# Altium project p4_mini_board.PrjPcb
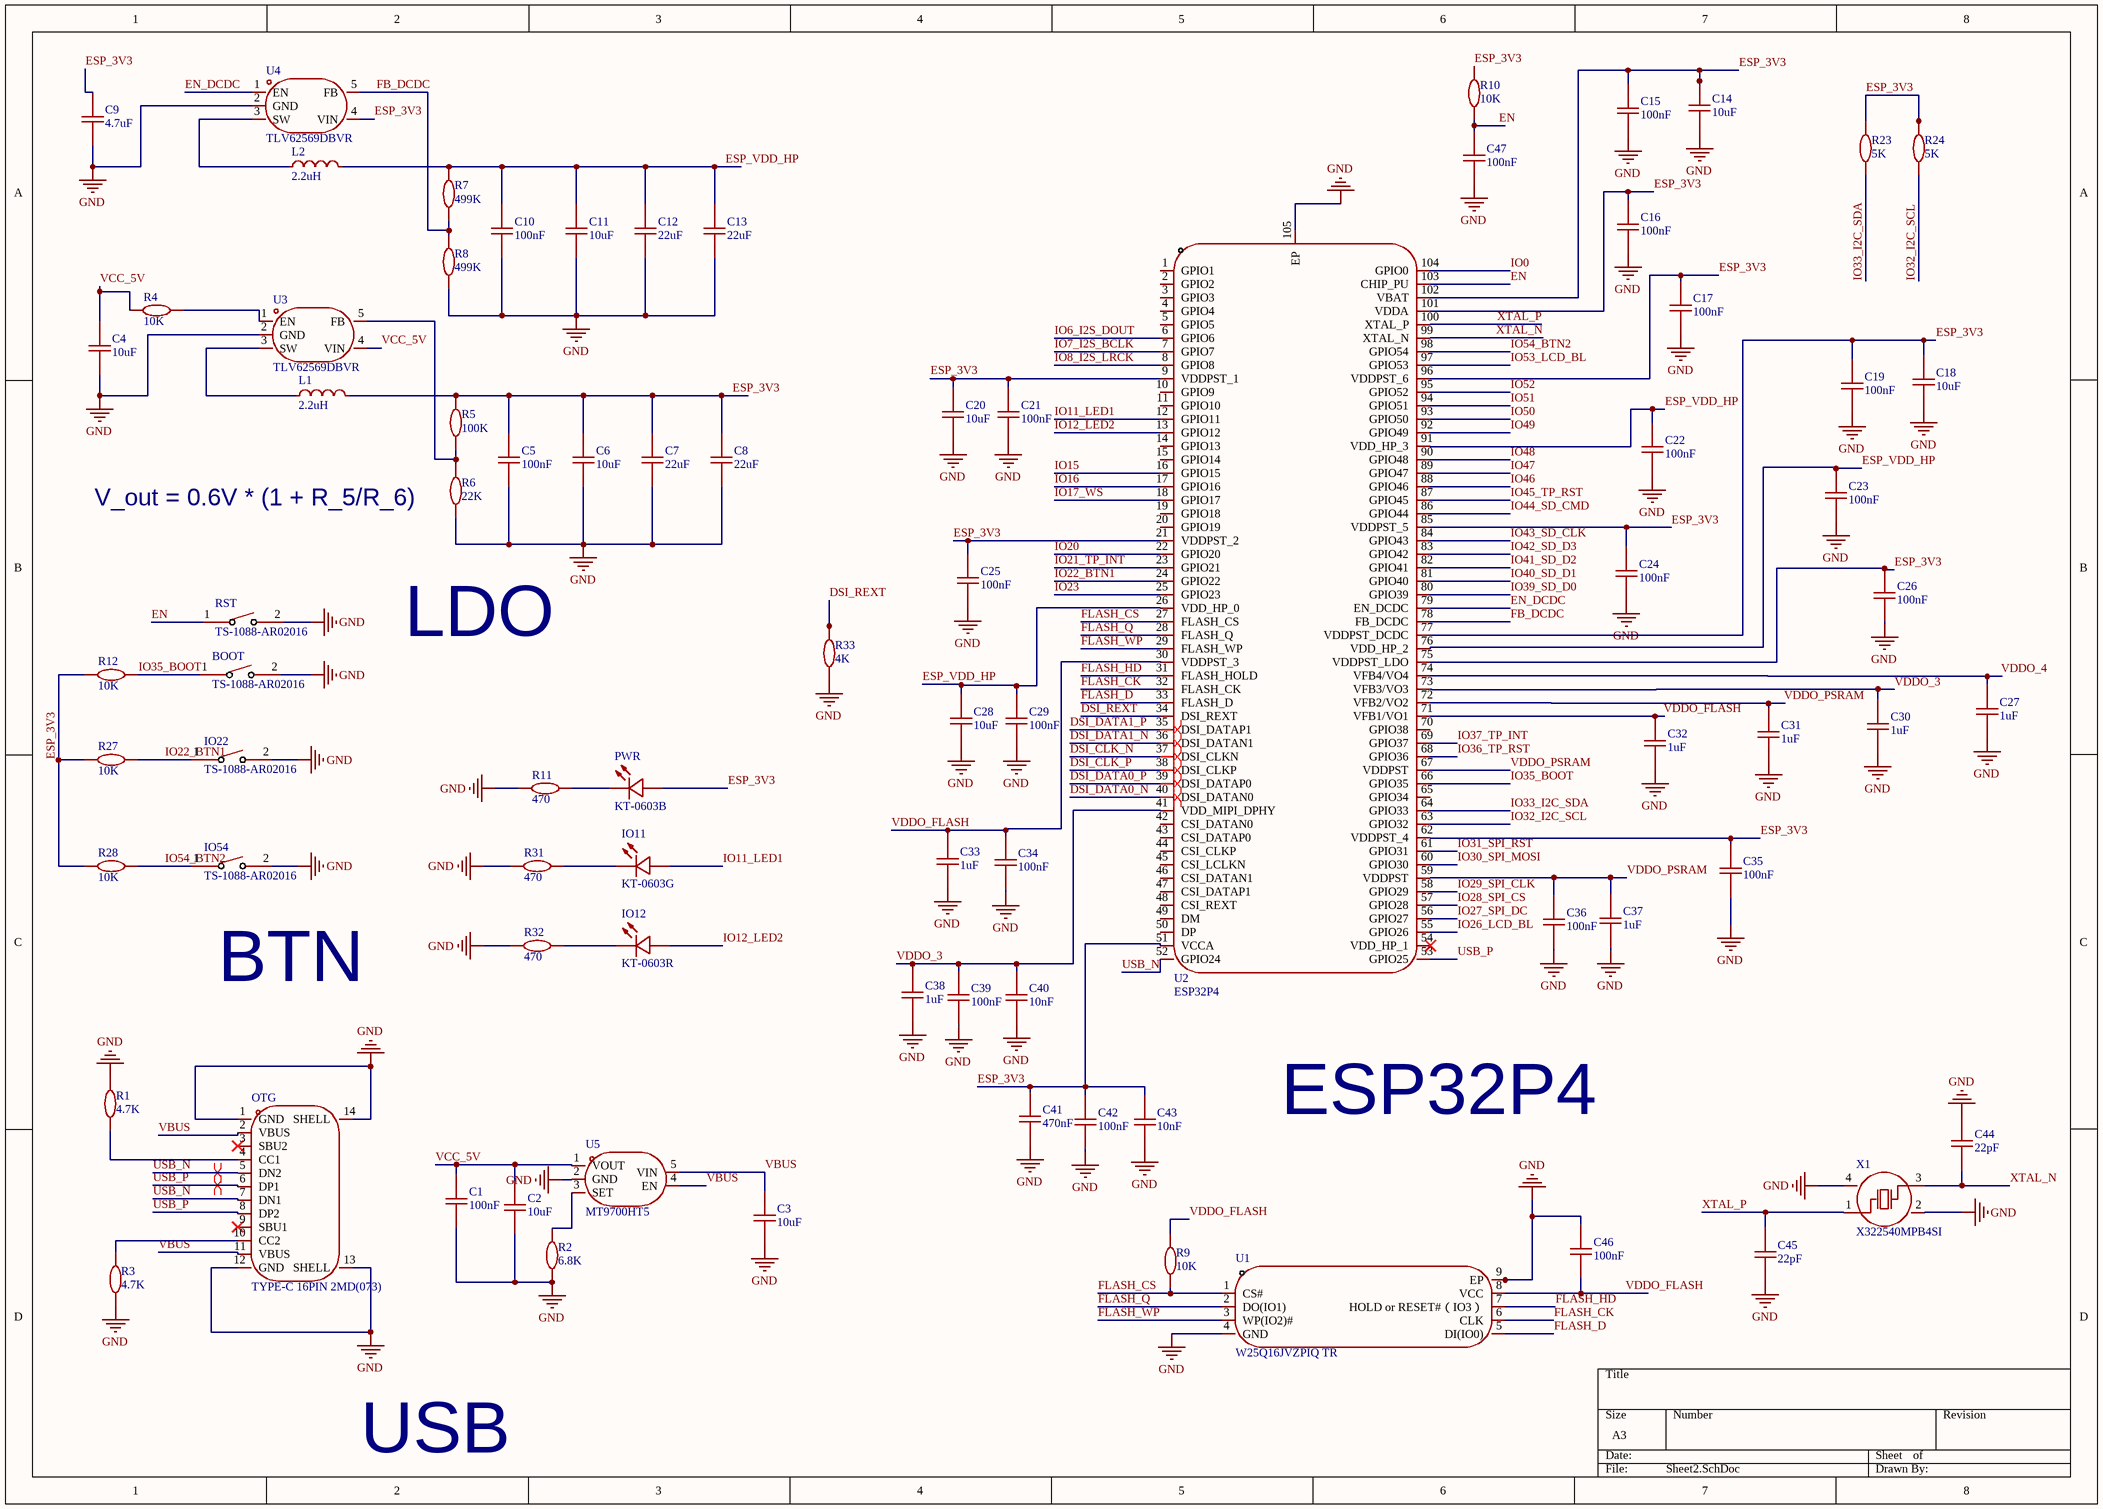
[diagram p0: Sheet2.SchDoc]
2 sheets, 119 parts. Net scope: global (net labels, ports and power ports of the same name join across sheets).
Board file: PCB2.PcbDoc
Sheets:
  Sheet2.SchDoc
  Sheet1.SchDoc

## Sheet Sheet2.SchDoc
size A3; SheetNumber: 1; SheetTotal: 2

### Parts
BOOT  TS-1088-AR02016  [SW-SMD_L3.9-W3.0-P4.45]
C1  100nF  [C0402]
C2  10uF  [C0603]
C3  10uF  [C0603]
C4  10uF  [C0603]
C5  100nF  [C0402]
C6  10uF  [C0603]
C7  22uF  [C0603]
C8  22uF  [C0603]
C9  4.7uF  [C0603]
C10  100nF  [C0402]
C11  10uF  [C0603]
C12  22uF  [C0603]
C13  22uF  [C0603]
C14  10uF  [C0603]
C15  100nF  [C0402]
C16  100nF  [C0402]
C17  100nF  [C0402]
C18  10uF  [C0603]
C19  100nF  [C0402]
C20  10uF  [C0603]
C21  100nF  [C0402]
C22  100nF  [C0402]
C23  100nF  [C0402]
C24  100nF  [C0402]
C25  100nF  [C0402]
C26  100nF  [C0402]
C27  1uF  [C0402]
C28  10uF  [C0603]
C29  100nF  [C0402]
C30  1uF  [C0402]
C31  1uF  [C0402]
C32  1uF  [C0402]
C33  1uF  [C0402]
C34  100nF  [C0402]
C35  100nF  [C0402]
C36  100nF  [C0402]
C37  1uF  [C0402]
C38  1uF  [C0402]
C39  100nF  [C0402]
C40  10nF  [C0402]
C41  470nF  [C0402]
C42  100nF  [C0402]
C43  10nF  [C0402]
C44  22pF  [C0402]
C45  22pF  [C0402]
C46  100nF  [C0402]
C47  100nF  [C0402]
IO11  KT-0603G  [LED0603-GR]
IO12  KT-0603R  [LED0603-RD]
IO22  TS-1088-AR02016  [SW-SMD_L3.9-W3.0-P4.45]
IO54  TS-1088-AR02016  [SW-SMD_L3.9-W3.0-P4.45]
L1  2.2uH  [L0402-SMD]
L2  2.2uH  [L0402-SMD]
OTG  TYPE-C 16PIN 2MD(073)  [USB-C-SMD_TYPE-C-6PIN-2MD-073]
PWR  KT-0603B  [LED0603-BL]
R1  4.7K  [R0402]
R2  6.8K  [R0402]
R3  4.7K  [R0402]
R4  10K  [R0402]
R5  100K  [R0402]
R6  22K  [R0402]
R7  499K  [R0402]
R8  499K  [R0402]
R9  10K  [R0402]
R10  10K  [R0402]
R11  470  [R0402]
R12  10K  [R0402]
R23  5K  [R0402]
R24  5K  [R0402]
R27  10K  [R0402]
R28  10K  [R0402]
R31  470  [R0402]
R32  470  [R0402]
R33  4K  [R0402]
RST  TS-1088-AR02016  [SW-SMD_L3.9-W3.0-P4.45]
U1  W25Q16JVZPIQ TR  [WSON-8_L6.0-W5.0-P1.27-BL-EP]
U2  ESP32P4  [QFN-104_L10.0-W10.0-P0.35-TL-EP7.5]
U3  TLV62569DBVR  [SOT-23-5_L3.0-W1.7-P0.95-LS2.8-BR]
U4  TLV62569DBVR  [SOT-23-5_L3.0-W1.7-P0.95-LS2.8-BR]
U5  MT9700HT5  [SOT-23-5_L3.0-W1.7-P0.95-LS2.8-BL]
X1  X322540MPB4SI  [OSC-SMD_4P-L3.2-W2.5-BL_SIT8008BI]

### Nets
GND: BOOT.2 C1.1 C2.2 C3.2 C4.2 C5.1 C6.1 C7.1 C8.1 C9.2 C10.1 C11.1 C12.1 C13.1 C14.1 C15.1 C16.1 C17.1 C18.1 C19.1 C20.1 C21.1 C22.1 C23.1 C24.1 C25.1 C26.1 C27.1 C28.1 C29.1 C30.1 C31.1 C32.1 C33.1 C34.1 C35.1 C36.1 C37.1 C38.1 C39.1 C40.1 C41.1 C42.1 C43.1 C44.2 C45.1 C46.2 C47.1 IO22.2 IO54.2 OTG.1(GND) OTG.12(GND) OTG.13(SHELL) OTG.14(SHELL) R1.2 R2.2 R3.1 R6.1 R8.1 R11.2 R31.2 R32.2 R33.2 RST.2 U1.4(GND) U1.9(EP) U2.105(EP) U3.2(GND) U4.2(GND) U5.2(GND) X1.2(GND) X1.4(GND)
DSI_CLK_N: U2.37(DSI_CLKN)
DSI_CLK_P: U2.38(DSI_CLKP)
DSI_DATA0_N: U2.40(DSI_DATAN0)
DSI_DATA0_P: U2.39(DSI_DATAP0)
DSI_DATA1_N: U2.36(DSI_DATAN1)
DSI_DATA1_P: U2.35(DSI_DATAP1)
DSI_REXT: R33.1 U2.34(DSI_REXT)
EN: C47.2 R10.1 RST.1 U2.103(CHIP_PU)
EN_DCDC: U2.79(EN_DCDC) U4.1(EN)
ESP_3V3: C5.2 C6.2 C7.2 C8.2 C9.1 C14.2 C15.2 C16.2 C17.2 C18.2 C19.2 C20.2 C21.2 C24.2 C25.2 C26.2 C35.2 C41.2 C42.2 C43.2 L1.2 PWR.2(A) R5.2 R10.2 R12.2 R23.2 R24.2 R27.2 R28.2 U2.9(VDDPST_1) U2.21(VDDPST_2) U2.51(VCCA) U2.62(VDDPST_4) U2.75(VDDPST_LDO) U2.77(VDDPST_DCDC) U2.85(VDDPST_5) U2.96(VDDPST_6) U2.101(VDDA) U2.102(VBAT) U4.4(VIN)
ESP_VDD_HP: C10.2 C11.2 C12.2 C13.2 C22.2 C23.2 C28.2 C29.2 L2.2 R7.2 U2.26(VDD_HP_0) U2.76(VDD_HP_2) U2.91(VDD_HP_3)
FB_DCDC: R7.1 R8.2 U2.78(FB_DCDC) U4.5(FB)
FLASH_CK: U1.6(CLK) U2.32(FLASH_CK)
FLASH_CS: R9.1 U1.1(CS#) U2.27(FLASH_CS)
FLASH_D: U1.5(DI(IO0)) U2.33(FLASH_D)
FLASH_HD: U1.7(HOLD_or_RESET#（IO3）) U2.31(FLASH_HOLD)
FLASH_Q: U1.2(DO(IO1)) U2.28(FLASH_Q)
FLASH_WP: U1.3(WP(IO2)#) U2.29(FLASH_WP)
IO0: U2.104(GPIO0)
IO6_I2S_DOUT: U2.6(GPIO6)
IO7_I2S_BCLK: U2.7(GPIO7)
IO8_I2S_LRCK: U2.8(GPIO8)
IO11_LED1: IO11.2(A) U2.12(GPIO11)
IO12_LED2: IO12.2(A) U2.13(GPIO12)
IO15: U2.16(GPIO15)
IO16: U2.17(GPIO16)
IO17_WS: U2.18(GPIO17)
IO20: U2.22(GPIO20)
IO21_TP_INT: U2.23(GPIO21)
IO22_BTN1: IO22.1 R27.1 U2.24(GPIO22)
IO23: U2.25(GPIO23)
IO26_LCD_BL: U2.55(GPIO26)
IO27_SPI_DC: U2.56(GPIO27)
IO28_SPI_CS: U2.57(GPIO28)
IO29_SPI_CLK: U2.58(GPIO29)
IO30_SPI_MOSI: U2.60(GPIO30)
IO31_SPI_RST: U2.61(GPIO31)
IO32_I2C_SCL: R24.1 U2.63(GPIO32)
IO33_I2C_SDA: R23.1 U2.64(GPIO33)
IO35_BOOT: BOOT.1 R12.1 U2.66(GPIO35)
IO36_TP_RST: U2.68(GPIO36)
IO37_TP_INT: U2.69(GPIO37)
IO39_SD_D0: U2.80(GPIO39)
IO40_SD_D1: U2.81(GPIO40)
IO41_SD_D2: U2.82(GPIO41)
IO42_SD_D3: U2.83(GPIO42)
IO43_SD_CLK: U2.84(GPIO43)
IO44_SD_CMD: U2.86(GPIO44)
IO45_TP_RST: U2.87(GPIO45)
IO46: U2.88(GPIO46)
IO47: U2.89(GPIO47)
IO48: U2.90(GPIO48)
IO49: U2.92(GPIO49)
IO50: U2.93(GPIO50)
IO51: U2.94(GPIO51)
IO52: U2.95(GPIO52)
IO53_LCD_BL: U2.97(GPIO53)
IO54_BTN2: IO54.1 R28.1 U2.98(GPIO54)
USB_N: OTG.5(DN2) OTG.7(DN1) U2.52(GPIO24)
USB_P: OTG.6(DP1) OTG.8(DP2) U2.53(GPIO25)
VBUS: C3.1 OTG.2(VBUS) OTG.11(VBUS) U5.4(EN) U5.5(VIN)
VCC_5V: C1.2 C2.1 C4.1 R4.2 U3.4(VIN) U5.1(VOUT)
VDDO_3: C30.2 C38.2 C39.2 C40.2 U2.41(VDD_MIPI_DPHY) U2.73(VFB3/VO3)
VDDO_4: C27.2 U2.74(VFB4/VO4)
VDDO_FLASH: C32.2 C33.2 C34.2 C46.1 R9.2 U1.8(VCC) U2.30(VDDPST_3) U2.71(VFB1/VO1)
VDDO_PSRAM: C31.2 C36.2 C37.2 U2.59(VDDPST) U2.67(VDDPST) U2.72(VFB2/VO2)
XTAL_N: C44.1 U2.99(XTAL_N) X1.3(OSC2)
XTAL_P: C45.2 U2.100(XTAL_P) X1.1(OSC1)
NetIO11_1: IO11.1(K) R31.1
NetIO12_1: IO12.1(K) R32.1
NetL1_1: L1.1 U3.3(SW)
NetL2_1: L2.1 U4.3(SW)
NetOTG_4: OTG.4(CC1) R1.1
NetOTG_10: OTG.10(CC2) R3.2
NetPWR_1: PWR.1(K) R11.1
NetR2_1: R2.1 U5.3(SET)
NetR4_1: R4.1 U3.1(EN)
NetR5_1: R5.1 R6.2 U3.5(FB)

Not connected (* = marked no-connect by the designer): OTG 3(SBU2)* 9(SBU1)*; U2 1(GPIO1) 2(GPIO2) 3(GPIO3) 4(GPIO4) 5(GPIO5) 10(GPIO9) 11(GPIO10) 14(GPIO13) 15(GPIO14) 19(GPIO18) 20(GPIO19) 42(CSI_DATAN0) 43(CSI_DATAP0) 44(CSI_CLKP) 45(CSI_LCLKN) 46(CSI_DATAN1) 47(CSI_DATAP1) 48(CSI_REXT) 49(DM) 50(DP) 54(VDD_HP_1)* 65(GPIO34) 70(GPIO38)

### Layout directives
differential pair: DSI_CLK_N, DSI_CLK_P, DSI_DATA0_N, DSI_DATA0_P, DSI_DATA1_N, DSI_DATA1_P, USB_N, USB_P

### Notes on the sheet
- (near R6) V_out = 0.6V * (1 + R_5/R_6)
- LDO
- (near IO54) BTN
- ESP32P4
- USB

### Library data of the parts
C1 C5 C10 C15-C17 C19 C21-C27 C29-C47 = C0402
C2-C4 C6-C9 C11-C14 C18 C20 C28 = C0603
L1 L2 = L0402-SMD
R1-R12 R23 R24 R27 R28 R31-R33 = R0402

## Sheet Sheet1.SchDoc
size A3; SheetNumber: 2; SheetTotal: 2
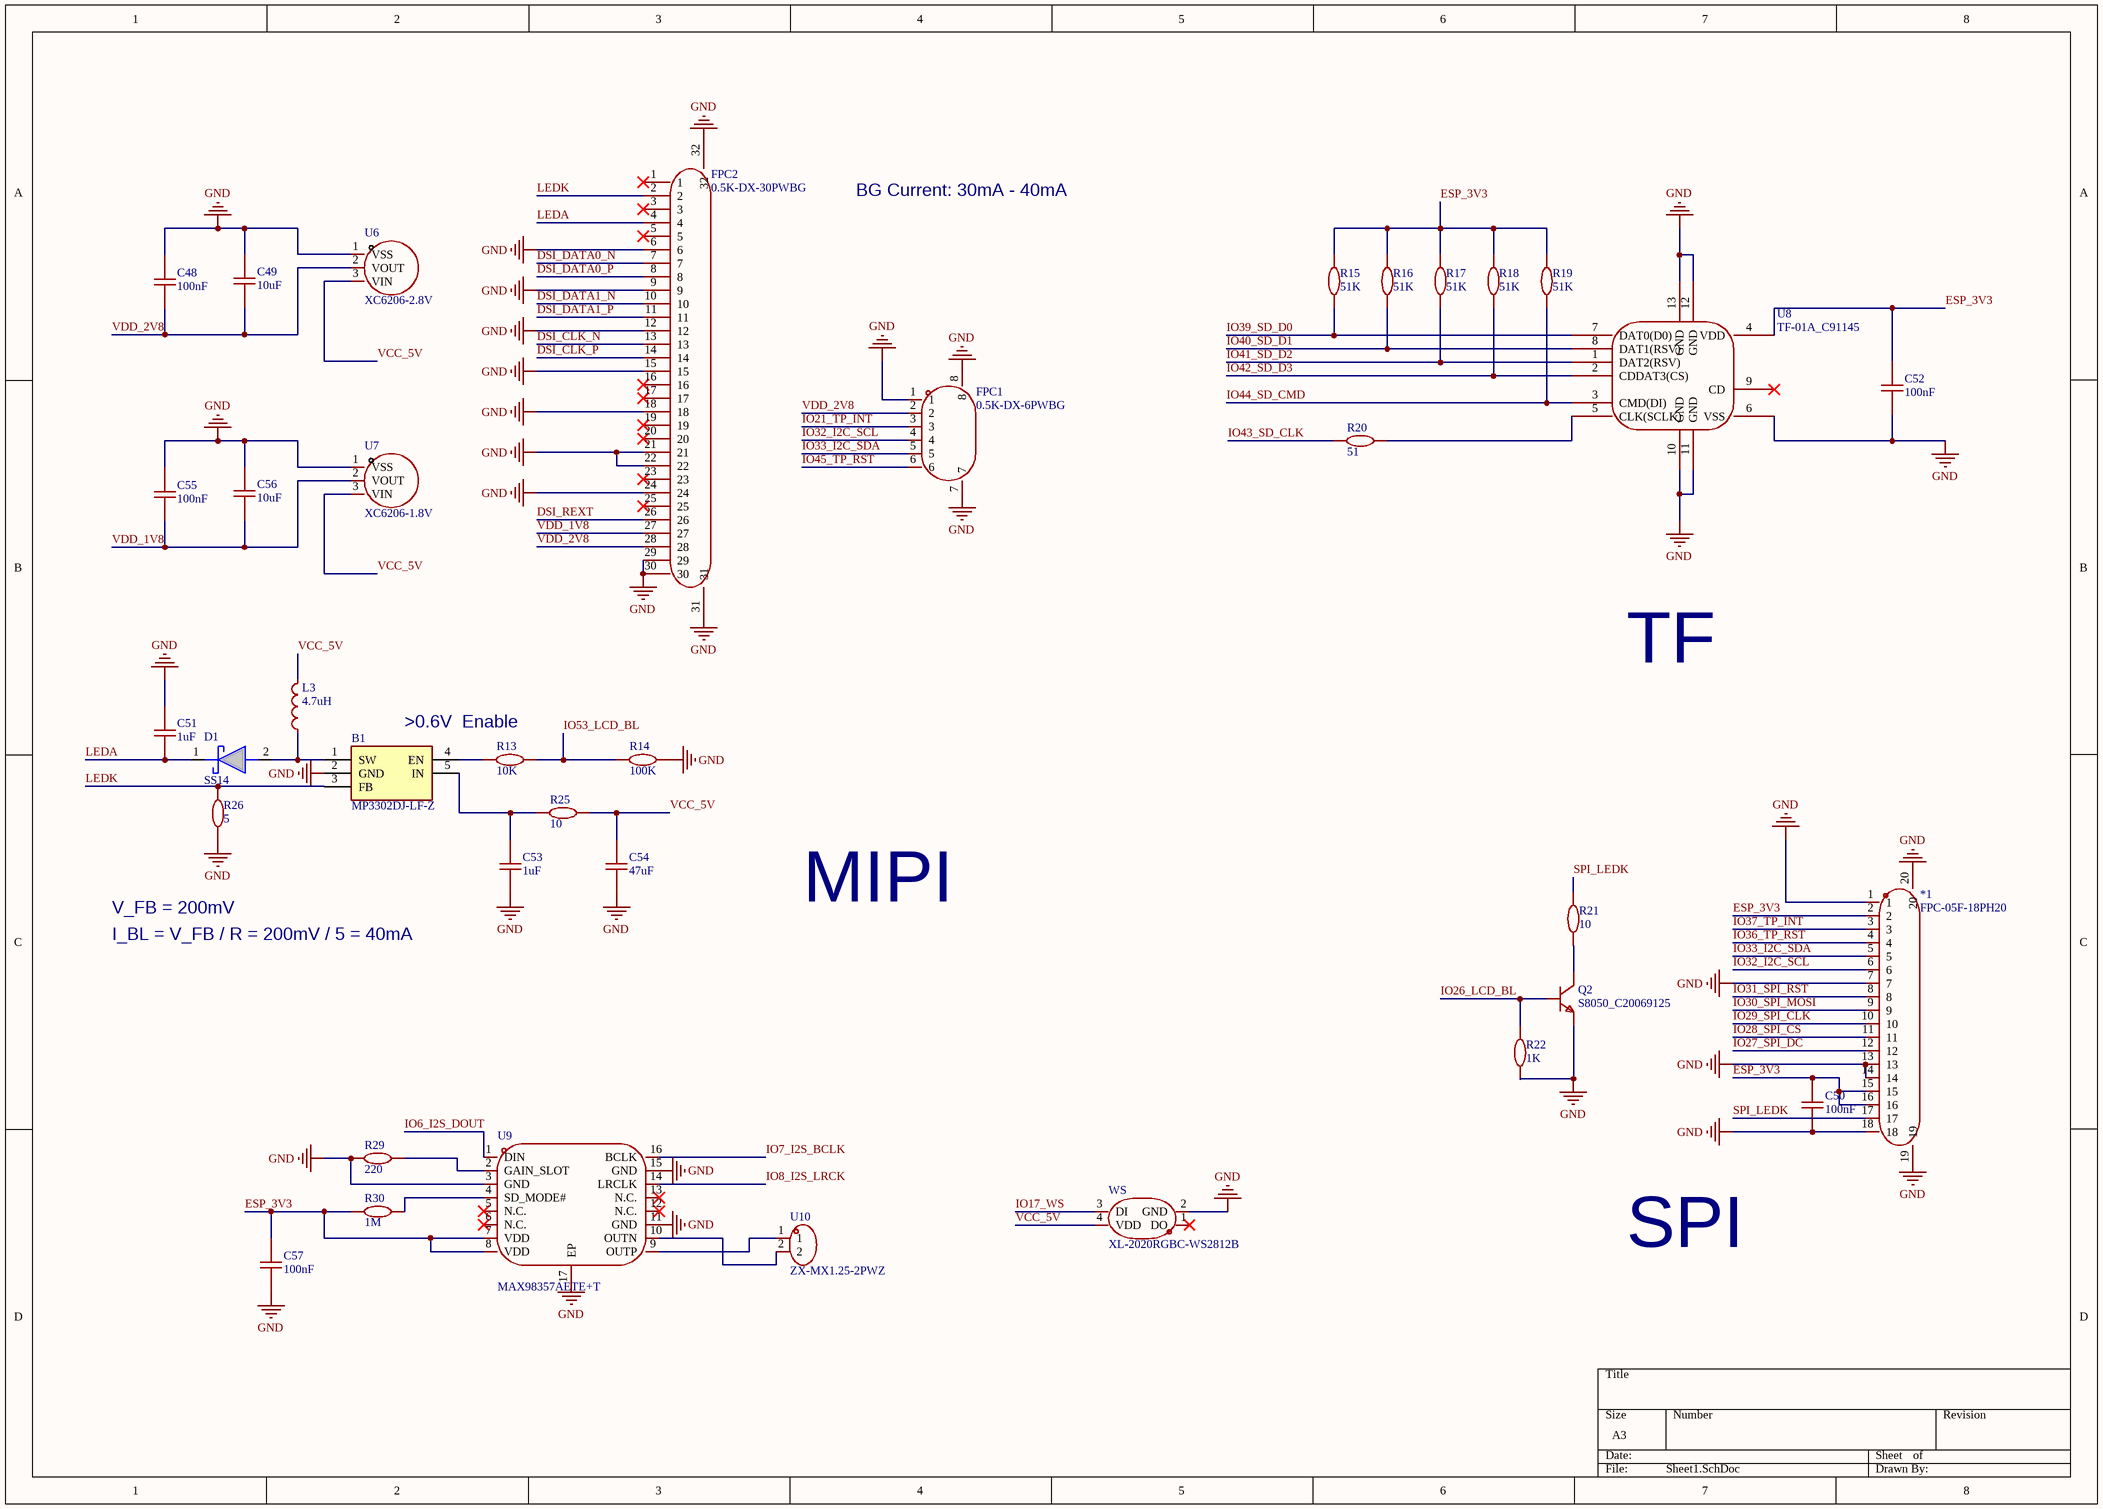
[diagram p1: Sheet1.SchDoc]

### Parts
*1  FPC-05F-18PH20  [FPC-SMD_18P-P0.50_FPC-05F-18PH20]
B1  MP3302DJ-LF-Z  [SOT95P280X100-5N]
C48  100nF  [C0402]
C49  10uF  [C0603]
C50  100nF  [C0402]
C51  1uF  [C0402]
C52  100nF  [C0402]
C53  1uF  [C0402]
C54  47uF  [C0603]
C55  100nF  [C0402]
C56  10uF  [C0603]
C57  100nF  [C0402]
D1  SS14  [DIOM5126X250N]
FPC1  0.5K-DX-6PWBG  [FPC-SMD_6P-P0.50_DEALON_0.5K-DX-6PWB]
FPC2  0.5K-DX-30PWBG  [FPC-SMD_6P-P0.50_DEALON_0.5K-DX-30PWB]
L3  4.7uH  [L0402-SMD]
Q2  S8050_C20069125  [SOT-23-3_L2.9-W1.3-P1.90-LS2.3-BR]
R13  10K  [R0402]
R14  100K  [R0402]
R15  51K  [R0402]
R16  51K  [R0402]
R17  51K  [R0402]
R18  51K  [R0402]
R19  51K  [R0402]
R20  51  [R0402]
R21  10  [R0402]
R22  1K  [R0402]
R25  10  [R0402]
R26  5  [R0402]
R29  220  [R0402]
R30  1M  [R0402]
U6  XC6206-2.8V  [SOT-23-3_L2.9-W1.6-P1.90-LS2.8-BR]
U7  XC6206-1.8V  [SOT-23-3_L2.9-W1.6-P1.90-LS2.8-BR]
U8  TF-01A_C91145  [TF-SMD_TF-01A]
U9  MAX98357AETE+T  [TQFN-16_L3.0-W3.0-P0.50-BL-EP1.5]
U10  ZX-MX1.25-2PWZ  [CONN-TH_2P-P1.25_ZX-MX1.25-2PWZ]
WS  XL-2020RGBC-WS2812B  [LED-SMD_4P-L2.0-W2.0-BR-1]

### Nets
GND: *1.1 *1.7 *1.13 *1.14 *1.18 *1.19 *1.20 B1.2(GND) C48.2 C49.2 C50.1 C51.2 C52.1 C53.1 C54.1 C55.2 C56.2 C57.1 FPC1.1 FPC1.7 FPC1.8 FPC2.6 FPC2.9 FPC2.12 FPC2.15 FPC2.18 FPC2.21 FPC2.22 FPC2.24 FPC2.29 FPC2.30 FPC2.31 FPC2.32 Q2.2(E) R14.1 R22.1 R26.2 R29.1 U6.1(VSS) U7.1(VSS) U8.6(VSS) U8.10(GND) U8.11(GND) U8.12(GND) U8.13(GND) U9.3(GND) U9.11(GND) U9.15(GND) U9.17(EP) WS.2(GND)
DSI_CLK_N: FPC2.13
DSI_CLK_P: FPC2.14
DSI_DATA0_N: FPC2.7
DSI_DATA0_P: FPC2.8
DSI_DATA1_N: FPC2.10
DSI_DATA1_P: FPC2.11
DSI_REXT: FPC2.26
ESP_3V3: *1.2 *1.15 *1.16 C50.2 C52.2 C57.2 R15.1 R16.1 R17.1 R18.1 R19.1 R30.1 U8.4(VDD) U9.7(VDD) U9.8(VDD)
IO6_I2S_DOUT: U9.1(DIN)
IO7_I2S_BCLK: U9.16(BCLK)
IO8_I2S_LRCK: U9.14(LRCLK)
IO17_WS: WS.3(DI)
IO21_TP_INT: FPC1.3
IO26_LCD_BL: Q2.1(B) R22.2
IO27_SPI_DC: *1.12
IO28_SPI_CS: *1.11
IO29_SPI_CLK: *1.10
IO30_SPI_MOSI: *1.9
IO31_SPI_RST: *1.8
IO32_I2C_SCL: *1.6 FPC1.4
IO33_I2C_SDA: *1.5 FPC1.5
IO36_TP_RST: *1.4
IO37_TP_INT: *1.3
IO39_SD_D0: R15.2 U8.7(DAT0(D0))
IO40_SD_D1: R16.2 U8.8(DAT1(RSV))
IO41_SD_D2: R17.2 U8.1(DAT2(RSV))
IO42_SD_D3: R18.2 U8.2(CDDAT3(CS))
IO43_SD_CLK: R20.1
IO44_SD_CMD: R19.2 U8.3(CMD(DI))
IO45_TP_RST: FPC1.6
IO53_LCD_BL: R13.1 R14.2
LEDA: C51.1 D1.1(K) FPC2.4
LEDK: B1.3(FB) FPC2.2 R26.1
SPI_LEDK: *1.17 R21.2
VCC_5V: C54.2 L3.2 R25.1 U6.3(VIN) U7.3(VIN) WS.4(VDD)
VDD_1V8: C55.1 C56.1 FPC2.27 U7.2(VOUT)
VDD_2V8: C48.1 C49.1 FPC1.2 FPC2.28 U6.2(VOUT)
NetB1_1: B1.1(SW) D1.2(A) L3.1
NetB1_4: B1.4(EN) R13.2
NetB1_5: B1.5(IN) C53.2 R25.2
NetQ2_3: Q2.3(C) R21.1
NetR20_2: R20.2 U8.5(CLK(SCLK))
NetR29_2: R29.2 U9.2(GAIN_SLOT)
NetR30_2: R30.2 U9.4(SD_MODE#)
NetU9_9: U9.9(OUTP) U10.1
NetU9_10: U9.10(OUTN) U10.2

Not connected (* = marked no-connect by the designer): FPC2 1* 3* 5* 16* 17* 19* 20* 23* 25*; U8 9(CD)*; U9 5(N.C.)* 6(N.C.)* 12(N.C.)* 13(N.C.)*; WS 1(DO)*

### Notes on the sheet
- BG Current: 30mA - 40mA
- TF
- >0.6V  Enable
- V_FB = 200mV
- MIPI
- I_BL = V_FB / R = 200mV / 5 = 40mA
- SPI

### Library data of the parts
B1 = MP3302DJ-LF-Z: LED Lighting Drivers 1.3A, 1.3MHz WLED Driver; Manufacturer_Name: Monolithic Power Systems (MPS); Geometry.Height: 1mm; Mouser Part Number: 946-MP3302DJLFZ; Mouser Price/Stock: https://www.mouser.co.uk/ProductDetail/Monolithic-Power-Systems-MPS/MP3302DJ-LF-Z?qs=rC7bBWoQAAmgkwFvMFHCAg%3D%3D; Manufacturer_Part_Number: MP3302DJ-LF-Z; Datasheet Link: https://componentsearchengine.com/Datasheets/1/MP3302DJ-LF-Z.pdf
C48 C50-C53 C55 C57 = C0402
C49 C54 C56 = C0603
D1 = SS14: TAIWAN SEMICONDUCTOR - SS14 - SCHOTTKY RECTIFIER, 1A, 40V, DO-214AC; Geometry.Height: 2.5mm; Mouser Part Number: 821-SS14; Mouser Price/Stock: https://www.mouser.co.uk/ProductDetail/Taiwan-Semiconductor/SS14?qs=JV7lzlMm3yLIdi0ESVd3YQ%3D%3D; Manufacturer_Name: Taiwan Semiconductor; Manufacturer_Part_Number: SS14; Datasheet Link: https://www.taiwansemi.com/assets/uploads/datasheet/SS12%20SERIES_Q2102.pdf
L3 = L0402-SMD
R13-R22 R25 R26 R29 R30 = R0402
U7 = XC6206-2.8V

## Nets that join several sheets
GND: Sheet2 (72 pins), Sheet1 (50 pins)
DSI_CLK_N: Sheet2 (U2.37), Sheet1 (FPC2.13)
DSI_CLK_P: Sheet2 (U2.38), Sheet1 (FPC2.14)
DSI_DATA0_N: Sheet2 (U2.40), Sheet1 (FPC2.7)
DSI_DATA0_P: Sheet2 (U2.39), Sheet1 (FPC2.8)
DSI_DATA1_N: Sheet2 (U2.36), Sheet1 (FPC2.10)
DSI_DATA1_P: Sheet2 (U2.35), Sheet1 (FPC2.11)
DSI_REXT: Sheet2 (R33.1 U2.34), Sheet1 (FPC2.26)
ESP_3V3: Sheet2 (40 pins), Sheet1 (15 pins)
IO6_I2S_DOUT: Sheet2 (U2.6), Sheet1 (U9.1)
IO7_I2S_BCLK: Sheet2 (U2.7), Sheet1 (U9.16)
IO8_I2S_LRCK: Sheet2 (U2.8), Sheet1 (U9.14)
IO17_WS: Sheet2 (U2.18), Sheet1 (WS.3)
IO21_TP_INT: Sheet2 (U2.23), Sheet1 (FPC1.3)
IO26_LCD_BL: Sheet2 (U2.55), Sheet1 (Q2.1 R22.2)
IO27_SPI_DC: Sheet2 (U2.56), Sheet1 (*1.12)
IO28_SPI_CS: Sheet2 (U2.57), Sheet1 (*1.11)
IO29_SPI_CLK: Sheet2 (U2.58), Sheet1 (*1.10)
IO30_SPI_MOSI: Sheet2 (U2.60), Sheet1 (*1.9)
IO31_SPI_RST: Sheet2 (U2.61), Sheet1 (*1.8)
IO32_I2C_SCL: Sheet2 (R24.1 U2.63), Sheet1 (*1.6 FPC1.4)
IO33_I2C_SDA: Sheet2 (R23.1 U2.64), Sheet1 (*1.5 FPC1.5)
IO36_TP_RST: Sheet2 (U2.68), Sheet1 (*1.4)
IO37_TP_INT: Sheet2 (U2.69), Sheet1 (*1.3)
IO39_SD_D0: Sheet2 (U2.80), Sheet1 (R15.2 U8.7)
IO40_SD_D1: Sheet2 (U2.81), Sheet1 (R16.2 U8.8)
IO41_SD_D2: Sheet2 (U2.82), Sheet1 (R17.2 U8.1)
IO42_SD_D3: Sheet2 (U2.83), Sheet1 (R18.2 U8.2)
IO43_SD_CLK: Sheet2 (U2.84), Sheet1 (R20.1)
IO44_SD_CMD: Sheet2 (U2.86), Sheet1 (R19.2 U8.3)
IO45_TP_RST: Sheet2 (U2.87), Sheet1 (FPC1.6)
IO53_LCD_BL: Sheet2 (U2.97), Sheet1 (R13.1 R14.2)
VCC_5V: Sheet2 (6 pins), Sheet1 (6 pins)